# EAGLE design MC_BX1 (EAGLE 9.4.2)
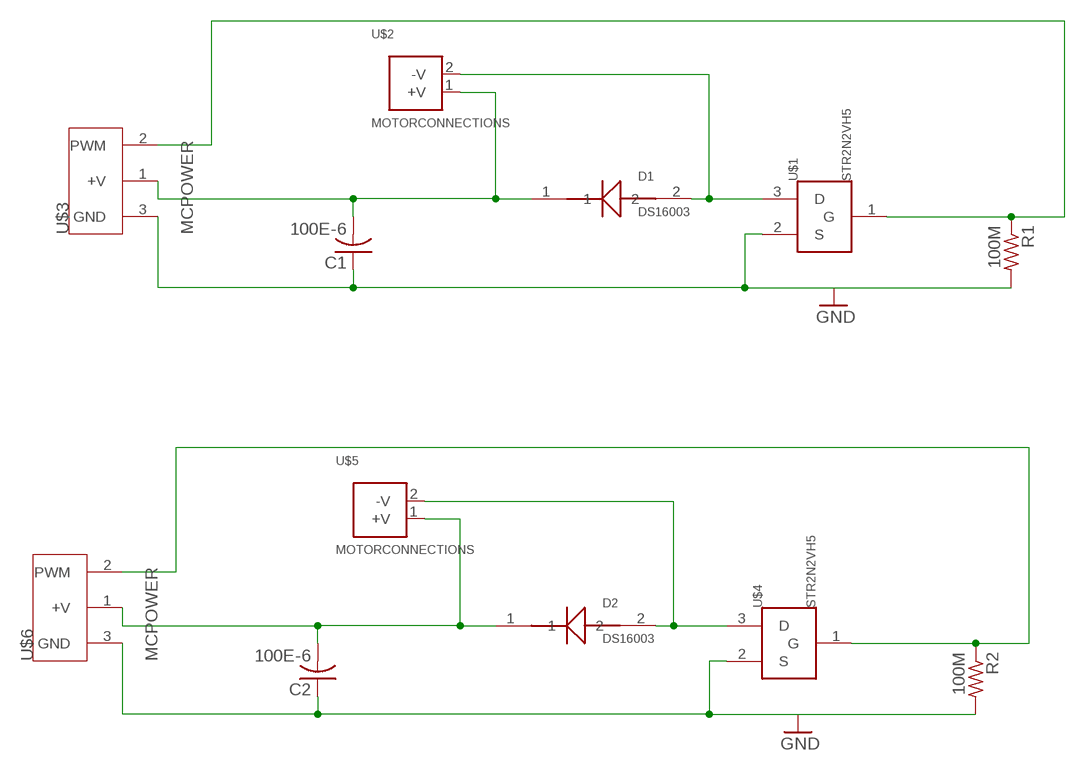
[diagram p0: schematic, sheet 1]

## Parts
C1  100E-6  C-USC0805  [C0805]
C2  100E-6  C-USC0805  [C0805]
D1  DS16003  [DS16003_F]
D2  DS16003  [DS16003_F]
R1  100M  R-US_R0805  [R0805]
R2  100M  R-US_R0805  [R0805]
U$1  STR2N2VH5  [T-STR2N2VH5_F]
U$2  MOTORCONNECTIONS  [MOTORCONNECTIONS]
U$3  MCPOWER  [MCPOWER]
U$4  STR2N2VH5  [T-STR2N2VH5_F]
U$5  MOTORCONNECTIONS  [MOTORCONNECTIONS]
U$6  MCPOWER  [MCPOWER]

## Nets
GND: C1.1 C2.1 R1.2 R2.2 U$1.2(S) U$3.3(GND) U$4.2(S) U$6.3(GND)
N$1: D1.2 U$1.3(D) U$2.2(-V)
N$2: D2.2 U$4.3(D) U$5.2(-V)
N$3: R1.1 U$1.1(G) U$3.2(PWM)
N$4: R2.1 U$4.1(G) U$6.2(PWM)
N$5: C2.2 D2.1 U$5.1(+V) U$6.1(+V)
N$8: C1.2 D1.1 U$2.1(+V) U$3.1(+V)

## Library data of the parts
C1 C2 = rcl:C-US: CAPACITOR, American symbol; SPICEPREFIX: C
D1 D2 = seds:DS16003: General purpose flyback diode.
R1 R2 = rcl:R-US_: RESISTOR, American symbol; SPICEPREFIX: R
U$1 U$4 = seds:STR2N2VH5: Field Effect Transistor
U$2 U$5 = seds:MOTORCONNECTIONS
U$3 U$6 = seds:MCPOWER

## Board
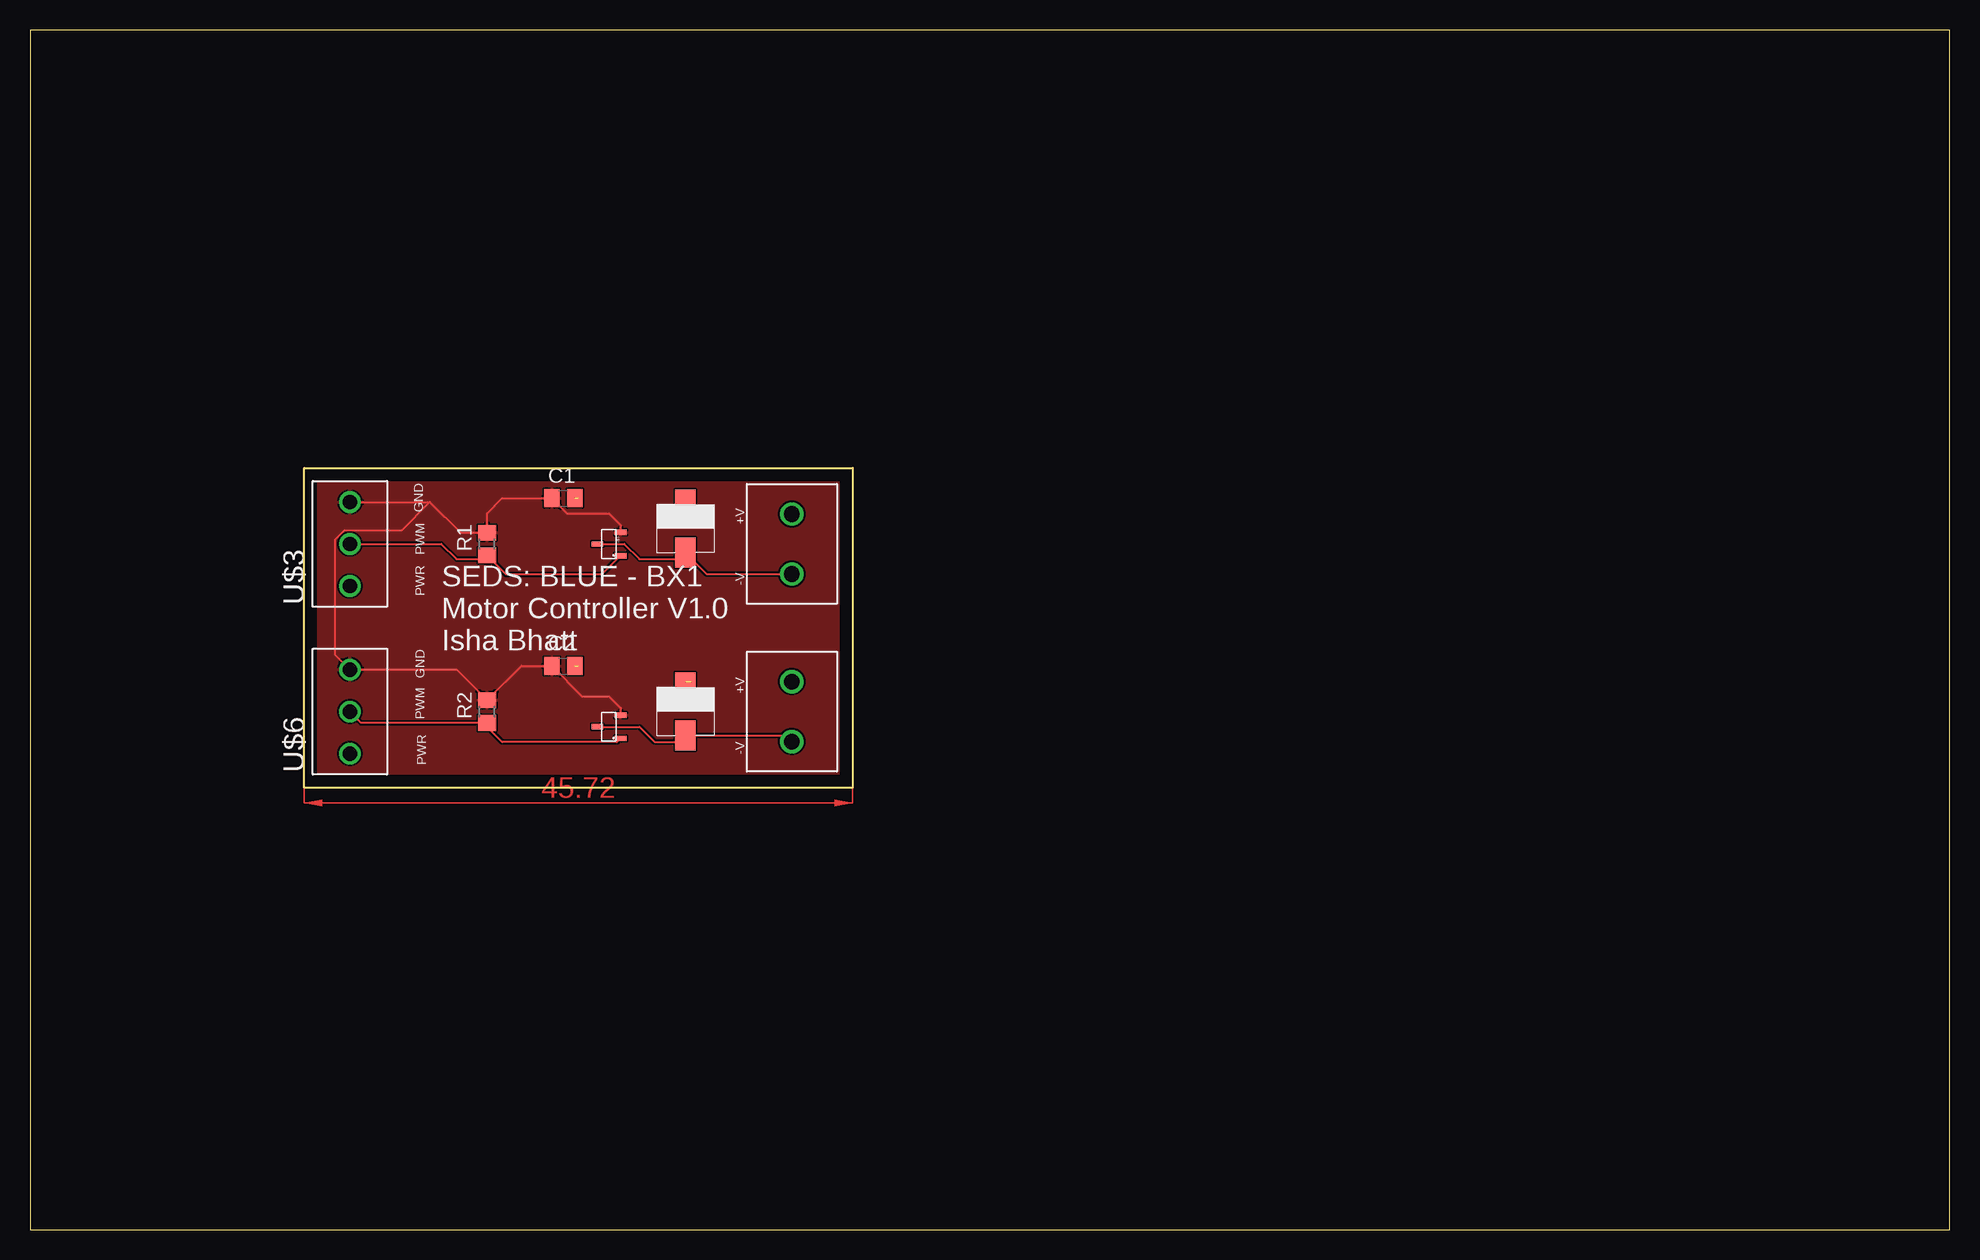
[diagram p1: board, top side]
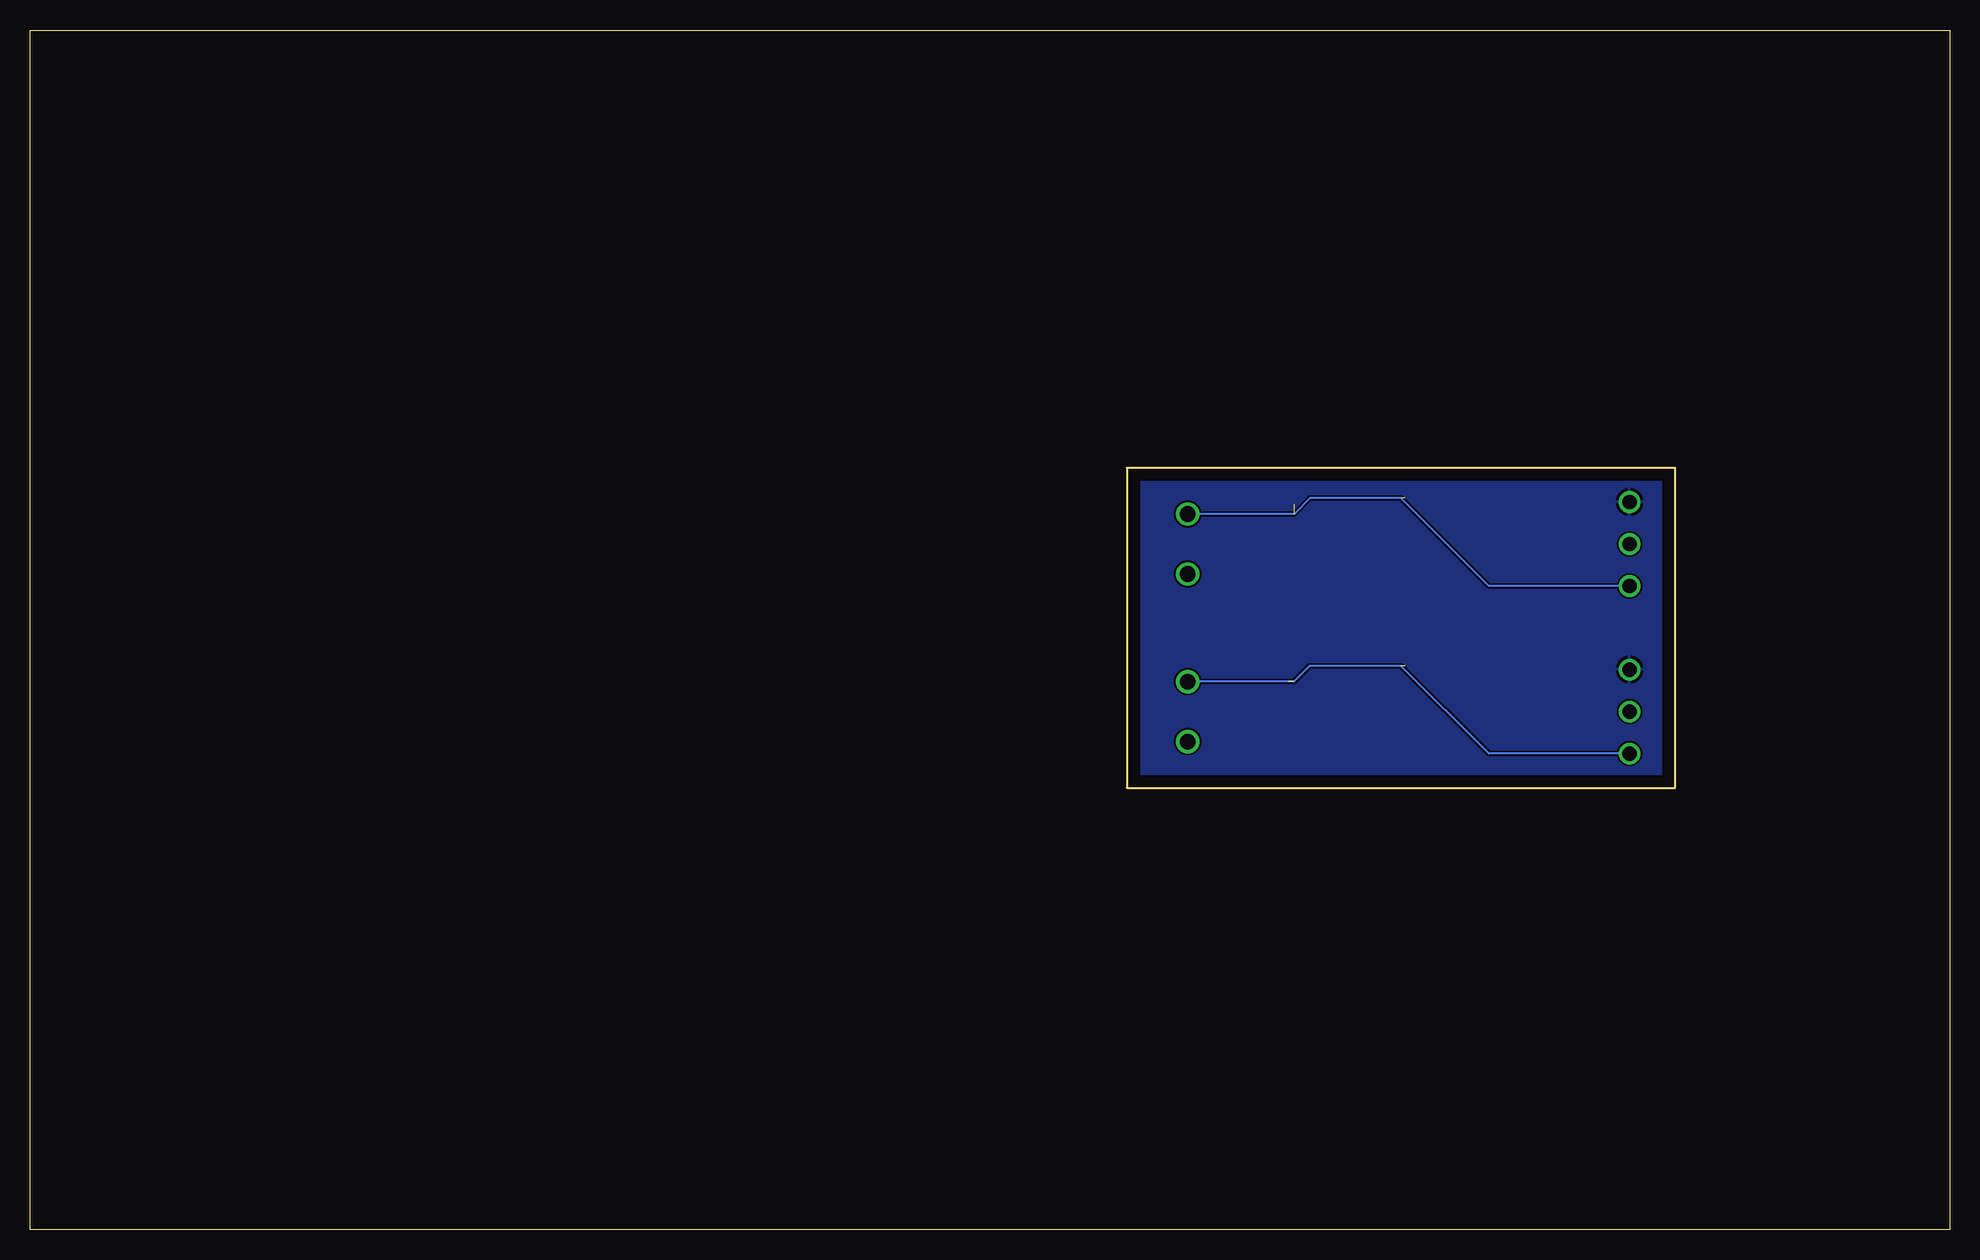
[diagram p2: board, bottom side, seen from below]

Size 160 x 100 mm. Coordinates in mm from the lower left corner, seen from the top.
Outline: 0,0 160,0 160,100 0,100 0,0
Outline: 22.86,63.5 68.58,63.5 68.58,36.83 22.86,36.83 22.86,63.5
Copper layers (1*16): Top 0.035mm / dielectric 1.5mm / Bottom 0.035mm
Design rules "default": minimum track width 6mil, minimum drill 0.35mm, track to track 6mil, track to pad 6mil, pad to pad 6mil, via to via 6mil, smd to smd 6mil, copper to edge 40mil, drill to drill 6mil, minimum pad ring 10mil, minimum via ring 8mil, stop-mask expansion 4mil, vias tented up to drill 0mil, thermal gap 10mil

### Footprints (pad centres in the part's own frame; a part is rotated, then mirrored left to right if it is on the bottom)
C0805 = smd 1.3 x 1.5: 1 -0.95,0; 2 0.95,0
DS16003_F = smd 2.5 x 1.7: 1 -2,0; 2 2,0
R0805 = smd 1.3 x 1.5: 1 -0.95,0; 2 0.95,0
T-STR2N2VH5_F = smd 0.45 x 0.98: 1 0.97,0.97; 2 -0.97,0.97; 3 0,-0.97
MOTORCONNECTIONS = drill 1.3: 1 -2.5,0; 2 2.5,0
MCPOWER = drill 1.2: 1 -3.5,0; 2 0,0; 3 3.5,0

### Placement (x,y rotation side)
C1  44.45,60.96 0 top
C2  44.45,46.99 0 top
D1  54.61,58.42 270 top
D2  54.61,43.18 270 top
R1  38.1,57.15 90 top
R2  38.1,43.18 90 top
U$1  48.26,57.15 270 top
U$2  63.5,57.15 270 top
U$3  26.67,57.15 90 top
U$4  48.26,41.91 270 top
U$5  63.5,43.18 270 top
U$6  26.67,43.18 90 top

### Tracks (layer width: path | path; a pad name or v marks a point on that pad's centre or on a via)
GND
  Top 0.152: U$3.3 33.33,60.65 | 33.33,60.65 35.88,58.1 R1.2 38.1,59.69 39.37,60.96 C1.1 44.77,59.69 48.26,59.69 49.23,58.72 U$1.2 | U$4.2 49.23,43.48 48.26,44.45 46.04,44.45 C2.1 40.96,46.99 R2.2 35.55,46.68 U$6.3 25.4,47.95 25.4,57.48 26.2,58.28 30.96,58.28 33.33,60.65
  pour Top: 22.86,63.5 68.58,63.5 68.58,36.83 22.86,36.83
  pour Bottom: 22.86,63.5 68.58,63.5 68.58,36.83 22.86,36.83
N$1
  Top 0.152: U$1.3 49.53,57.15 50.8,55.88 54.07,55.88 D1.2 56.38,54.65 U$2.2
N$2
  Top 0.152: U$4.3 50.8,41.91 52.07,40.64 54.07,40.64 D2.2 63,41.18 U$5.2
N$3
  Top 0.152: U$1.1 47.66,54.61 39.69,54.61 38.26,56.04 | 38.26,56.04 R1.1 | U$3.2 34.29,57.15 35.56,55.88 38.1,55.88 38.26,56.04
N$4
  Top 0.152: U$4.1 48.93,40.64 39.37,40.64 38.1,41.91 R2.1 27.62,42.23 U$6.2
N$5  (2 unrouted)
  Top 0.152: D2.1 55.11,45.68
  Bottom 0.152: U$6.1 38.41,39.68 45.72,46.99 53.34,46.99 54.65,45.68 U$5.1
N$6
  pour Top: 22.86,63.5 68.58,63.5 68.58,36.83 22.86,36.83
N$8  (2 unrouted)
  Top 0.152: 54.07,60.96 D1.1
  Bottom 0.152: U$3.1 38.41,53.65 45.72,60.96 53.3,60.96 54.61,59.65 U$2.1
(copper drawn outside any net)
  shapes: Top area x1

### Text on the board
tPlace: GND | +V | PWM | -V | PWR | SEDS: BLUE - BX1 / Motor Controller V1.0 / Isha Bhatt | GND | +V | PWM | -V | PWR